# EAGLE design tasten (EAGLE 5.06)
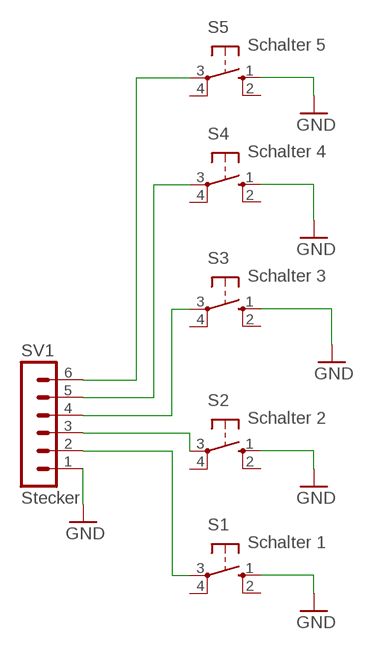
[diagram p0: schematic, sheet 1]

## Parts
S1  Schalter 1  10-XX  [B3F-10XX]
S2  Schalter 2  10-XX  [B3F-10XX]
S3  Schalter 3  10-XX  [B3F-10XX]
S4  Schalter 4  10-XX  [B3F-10XX]
S5  Schalter 5  10-XX  [B3F-10XX]
SV1  Stecker  MA06-1  [MA06-1]

## Nets
GND: S1.1(S) S2.1(S) S3.1(S) S4.1(S) S5.1(S) SV1.1
N$1: S2.3(P) SV1.3
N$2: S1.3(P) SV1.2
N$3: S3.3(P) SV1.4
N$4: S4.3(P) SV1.5
N$5: S5.3(P) SV1.6
Unconnected: S1.2(S1) S1.4(P1) S2.2(S1) S2.4(P1) S3.2(S1) S3.4(P1) S4.2(S1) S4.4(P1) S5.2(S1) S5.4(P1)

## Library data of the parts
S1-S5 = switch-omron:10-XX: OMRON SWITCH
SV1 = con-lstb:MA06-1: PIN HEADER

## Board
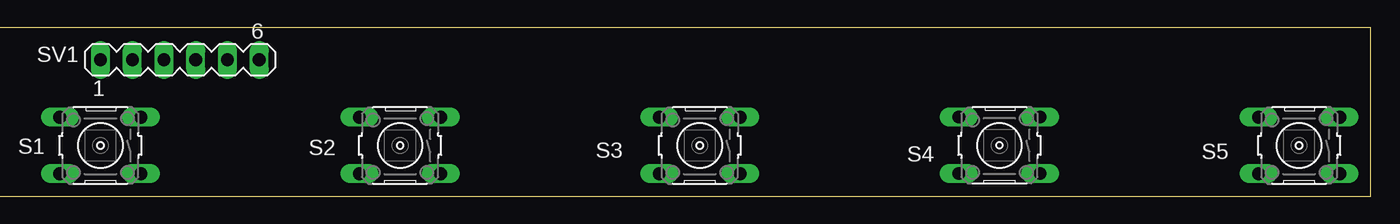
[diagram p1: board, top side]
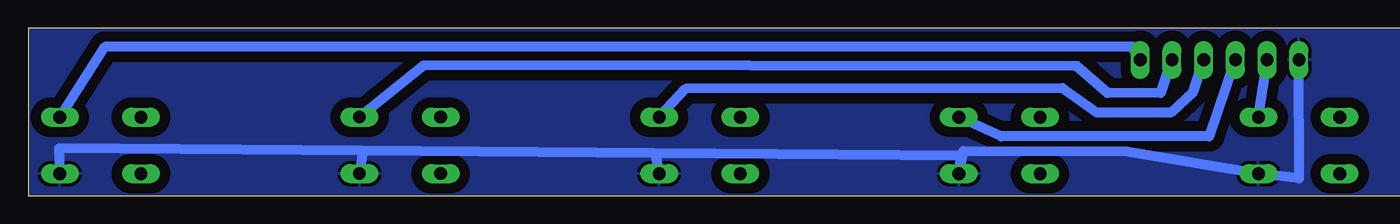
[diagram p2: board, bottom side, seen from below]

No outline drawn. Coordinates in mm, seen from the top.
Copper layers (1*16): Top 0.035mm / dielectric 1.5mm / Bottom 0.035mm
Design rules "0.3mm": minimum track width 10mil, minimum drill 24mil, track to track 0.3mm, track to pad 0.3mm, pad to pad 0.3mm, via to via 0.3mm, smd to smd 0.3mm, copper to edge 0mil, drill to drill 8mil, minimum pad ring 10mil, minimum via ring 8mil, stop-mask expansion 4mil, vias tented up to drill 0mil, thermal gap 10mil
Milling: 4 lines

### Footprints (pad centres in the part's own frame; a part is rotated, then mirrored left to right if it is on the bottom)
B3F-10XX = drill 1.016 long: 1 -3.251,2.261; 2 3.251,2.261; 3 -3.251,-2.261; 4 3.251,-2.261
MA06-1 = drill 1.016 long: 1 -6.35,0; 2 -3.81,0; 3 -1.27,0; 4 1.27,0; 5 3.81,0; 6 6.35,0

### Placement (x,y rotation side)
S1  8.27,4.05 180 top
S2  32.27,4.05 180 top
S3  56.27,4.05 180 top
S4  80.27,4.06 180 top
S5  104.27,4.05 180 top
SV1  14.64,10.91 0 top

### Tracks (layer width: path | path; a pad name or v marks a point on that pad's centre or on a via)
GND
  Bottom 0.813: SV1.1 8.26,1.42 S1.1 22.06,3.55 35.19,3.59 S2.1 35.37,3.21 59.86,3.42 | 59.86,3.42 83.25,3.61 | 83.25,3.61 107.6,3.82 S5.1 | 83.25,3.61 S4.1 | 59.86,3.42 S3.1
  pour Bottom (isolate 0.813): 0,0 110,0 110,13.46 0,13.46
N$1
  Bottom 0.813: S2.3 32.14,4.78 15.47,4.78 SV1.3
N$2
  Bottom 0.813: S1.3 10.89,10.39 SV1.2
N$3
  Bottom 0.813: S3.3 57.4,8.59 27.23,8.65 24.48,6.68 18.55,6.68 16.76,8.35 SV1.4
N$4
  Bottom 0.813: S4.3 78.35,10.47 26.05,10.41 23.63,8.26 19.35,8.24 SV1.5
N$5
  Bottom 0.813: S5.3 103.91,11.95 21.61,11.97 SV1.6